# Altium schematic sheet commu.SchDoc
size A4
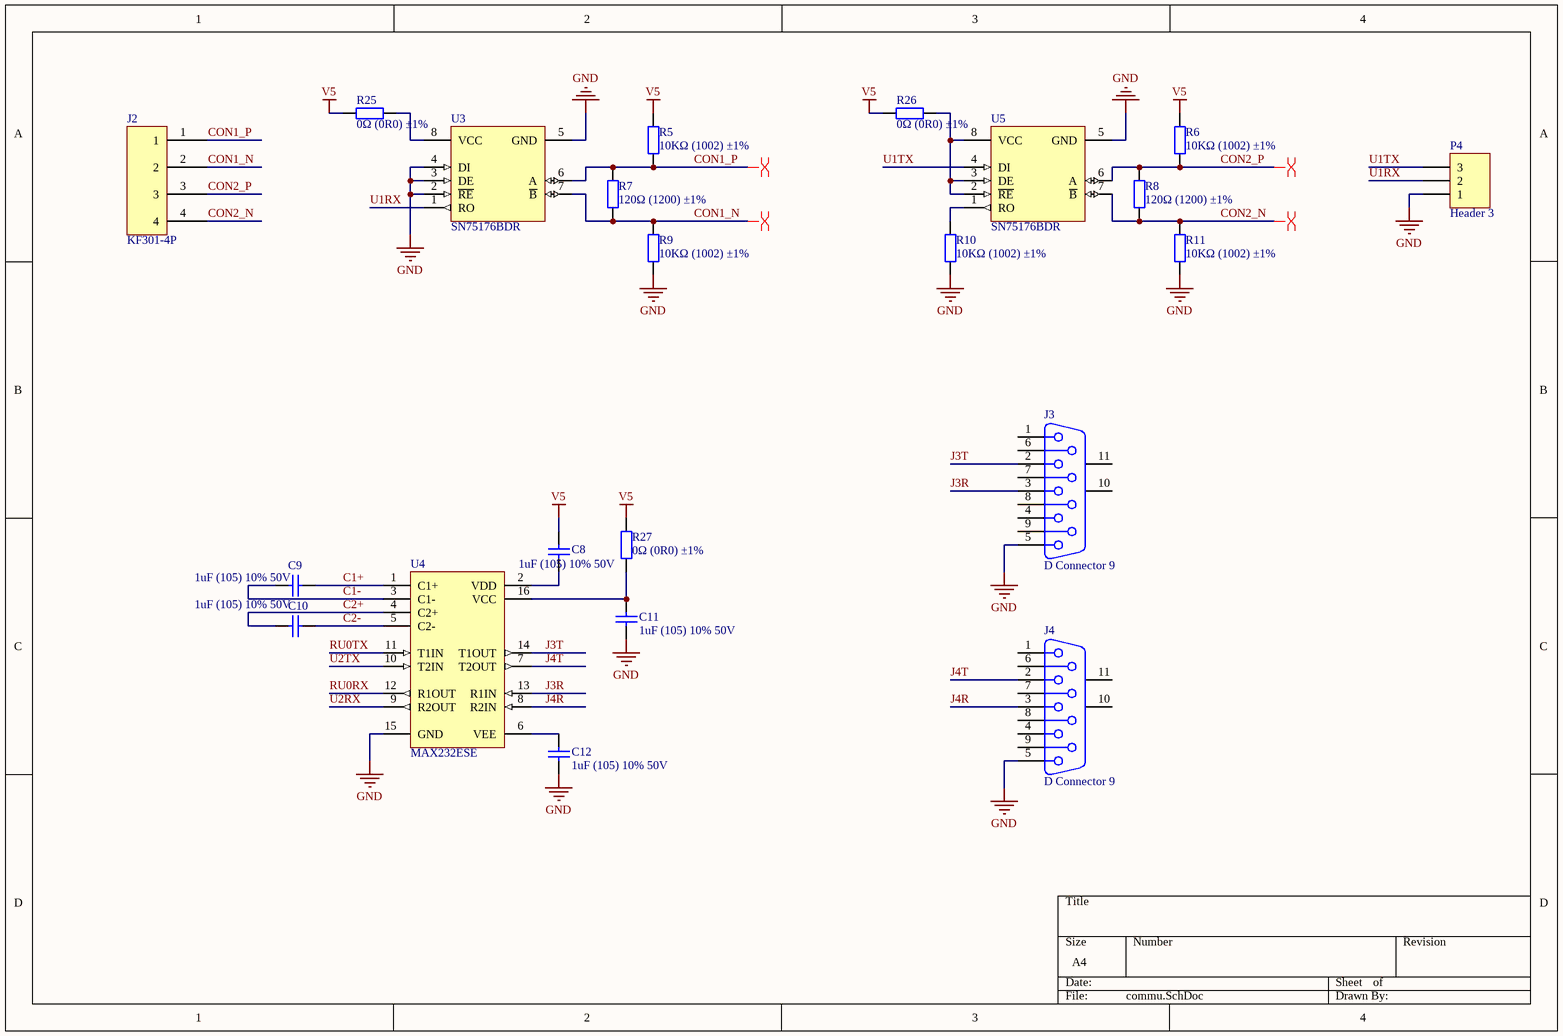
[diagram p0: commu.SchDoc]

## Parts
C8  1uF (105) 10% 50V  [0603_C]
C9  1uF (105) 10% 50V  [0603_C]
C10  1uF (105) 10% 50V  [0603_C]
C11  1uF (105) 10% 50V  [0603_C]
C12  1uF (105) 10% 50V  [0603_C]
J2  KF301-4P  [KF301-4P]
J3  D Connector 9  [DSUB1.385-2H9]
J4  D Connector 9  [DSUB1.385-2H9]
P4  Header 3  [HDR1X3]
R5  10KΩ (1002) ±1%  [0603_R]
R6  10KΩ (1002) ±1%  [0603_R]
R7  120Ω (1200) ±1%  [0603_R]
R8  120Ω (1200) ±1%  [0603_R]
R9  10KΩ (1002) ±1%  [0603_R]
R10  10KΩ (1002) ±1%  [0603_R]
R11  10KΩ (1002) ±1%  [0603_R]
R25  0Ω (0R0) ±1%  [1206_R]
R26  0Ω (0R0) ±1%  [1206_R]
R27  0Ω (0R0) ±1%  [1206_R]
U3  SN75176BDR  [SOIC-8_150mil]
U4  MAX232ESE  [SOIC-16_150mil]
U5  SN75176BDR  [SOIC-8_150mil]

## Nets
GND: C11.1 C12.1 J3.5 J4.5 P4.1 R9.1 R10.1 R11.1 U3.2(~{RE}) U3.3(DE) U3.4(DI) U3.5(GND) U4.15(GND) U5.5(GND)
V5: C8.2 R5.2 R6.2 R25.1 R26.1 R27.2
C1+: C9.2 U4.1(C1+)
C1-: C9.1 U4.3(C1-)
C2+: C10.1 U4.4(C2+)
C2-: C10.2 U4.5(C2-)
CON1_N: J2.2 R7.1 R9.2 U3.7(~{B})
CON1_P: J2.1 R5.1 R7.2 U3.6(A)
CON2_N: J2.4 R8.1 R11.2 U5.7(~{B})
CON2_P: J2.3 R6.1 R8.2 U5.6(A)
J3R: J3.3 U4.13(R1IN)
J3T: J3.2 U4.14(T1OUT)
J4R: J4.3 U4.8(R2IN)
J4T: J4.2 U4.7(T2OUT)
RU0RX: U4.12(R1OUT)
RU0TX: U4.11(T1IN)
U1RX: P4.2 U3.1(RO)
U1TX: P4.3 U5.4(DI)
U2RX: U4.9(R2OUT)
U2TX: U4.10(T2IN)
NetC8_1: C8.1 U4.2(VDD)
NetC11_2: C11.2 R27.1 U4.16(VCC)
NetC12_2: C12.2 U4.6(VEE)
NetR10_2: R10.2 U5.1(RO)
NetR25_2: R25.2 U3.8(VCC)
NetR26_2: R26.2 U5.2(~{RE}) U5.3(DE) U5.8(VCC)

Not connected (* = marked no-connect by the designer): J3 1 4 6 7 8 9 10(MH1) 11(MH2); J4 1 4 6 7 8 9 10(MH1) 11(MH2)

## Layout directives
differential pair: CON1_N, CON1_P, CON2_N, CON2_P

## Library data of the parts
C8-C12 = 0603 1uF (105) 10% 50V: 贴片电容; ComponentLink1Description: 供应商链接; ComponentLink1URL: http://www.szlcsc.com/product/details_16531.html; Package: 0603; Supplier: LC; SuppliersPartNumber: C15849
J3 J4 = D Connector 9: Receptacle Assembly, 9 Position, Right Angle; PackageDocument: O; Positions: 9; Published: 15-Jun-2001; LatestRevisionDate: 17-Jul-2002; LatestRevisionNote: Re-released for DXP Platform.; DatasheetDocument: 1-Sep-1999; PackageReference: 788750; Publisher: Altium Limited; Orientation: Right Angle; Gender: Receptacle
P4 = Header 3: Header, 3-Pin; LatestRevisionDate: 17-Jul-2002; LatestRevisionNote: Re-released for DXP Platform.; Publisher: Altium Limited
R5 R6 R9-R11 = 0603 10KΩ (1002) 1%: 贴片电阻; ComponentLink1Description: 供应商链接; ComponentLink1URL: http://www.szlcsc.com/product/details_26547.html; Package: 0603; Supplier: LC; SuppliersPartNumber: C25804
R7 R8 = 0603 120Ω (1200) 1%: 贴片电阻; ComponentLink1Description: 供应商链接; ComponentLink1URL: http://www.szlcsc.com/product/details_23514.html; Package: 0603; Supplier: LC; SuppliersPartNumber: C22787
R25-R27 = 1206 0Ω (0R0) 1%: 贴片电阻; ComponentLink1Description: 供应商链接; ComponentLink1URL: http://www.szlcsc.com/product/details_18576.html; Package: 1206; Supplier: LC; SuppliersPartNumber: C17888
U3 U5 = SN75176BDR_[C7063]: RS-485/RS-422; ComponentLink1Description: 供应商链接; ComponentLink1URL: http://www.szlcsc.com/product/details_7535.html; Package: SOIC-8_150mil; Supplier: LC; SuppliersPartNumber: C7063
U4 = MAX232ESE_[C26860]: RS232; ComponentLink1Description: 供应商链接; ComponentLink1URL: http://www.szlcsc.com/product/details_27608.html; Package: SOIC-16_150mil; Supplier: LC; SuppliersPartNumber: C26860